# Altium project WWM.PrjPcb (part 1 of 2)
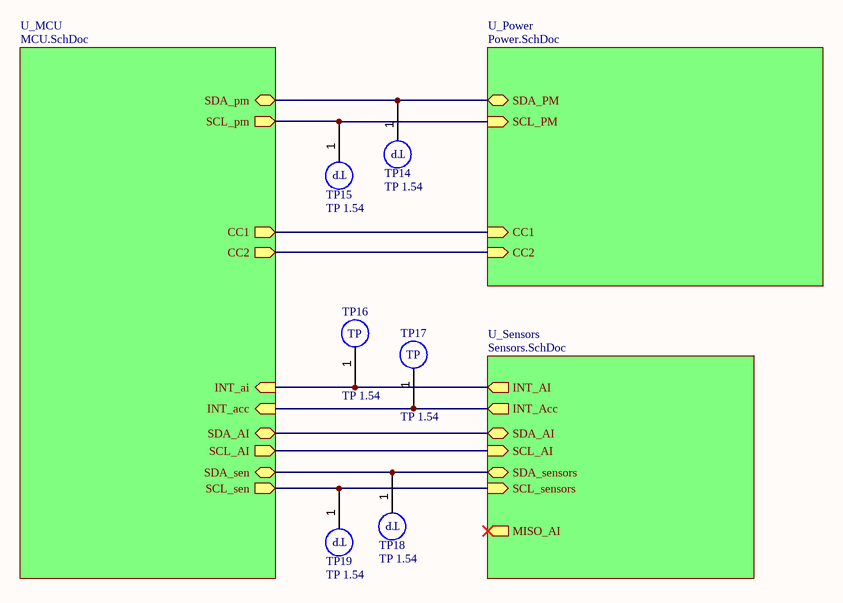
[diagram p0: Main_Sheet.SchDoc]
4 sheets, 114 parts. Net scope: hierarchical (ports join the sheet entries above them; power ports are global).
Board file: PCB1.PcbDoc
Sheets:
  Main_Sheet.SchDoc
    U_Power = Power.SchDoc
    U_Sensors = Sensors.SchDoc
    U_MCU = MCU.SchDoc

## Sheet Main_Sheet.SchDoc
size 431 x 279 mm; SheetNumber: 1; SheetTotal: 4

### Parts
TP14  TP 1.54  [TP-Footprint-1]  (no BOM)
TP15  TP 1.54  [TP-Footprint-1]  (no BOM)
TP16  TP 1.54  [TP-Footprint-1]  (no BOM)
TP17  TP 1.54  [TP-Footprint-1]  (no BOM)
TP18  TP 1.54  [TP-Footprint-1]  (no BOM)
TP19  TP 1.54  [TP-Footprint-1]  (no BOM)

### Sub-sheets
U_MCU = MCU.SchDoc: SDA_sen (bidir), SCL_sen (out), SDA_pm (bidir), INT_acc (in), INT_ai (in), CC2 (out), CC1 (out), SCL_pm (out), SCL_AI (out), SDA_AI (bidir)
U_Power = Power.SchDoc: SDA_PM (bidir), CC1 (in), CC2 (in), SCL_PM (in)
U_Sensors = Sensors.SchDoc: MISO_AI (out), SDA_sensors (bidir), SCL_sensors (in), INT_AI (out), INT_Acc (out), SDA_AI (bidir), SCL_AI (in)

### Nets
CC1: sheet U_Power/CC1, sheet U_MCU/CC1
CC2: sheet U_Power/CC2, sheet U_MCU/CC2
INT1_Acc: TP17.1 ; sheet U_Sensors/INT_Acc, sheet U_MCU/INT_acc
INT_AI: TP16.1 ; sheet U_Sensors/INT_AI, sheet U_MCU/INT_ai
SCL_Acc: TP19.1 ; sheet U_Sensors/SCL_sensors, sheet U_MCU/SCL_sen
SCL_AI: sheet U_Sensors/SCL_AI, sheet U_MCU/SCL_AI
SCL_PM: TP15.1 ; sheet U_Power/SCL_PM, sheet U_MCU/SCL_pm
SDA_Acc: TP18.1 ; sheet U_Sensors/SDA_sensors, sheet U_MCU/SDA_sen
SDA_MOSI_AI: sheet U_Sensors/SDA_AI, sheet U_MCU/SDA_AI
SDA_PM: TP14.1 ; sheet U_Power/SDA_PM, sheet U_MCU/SDA_pm

### Notes on the sheet
- DWG. NO.
- REV.
- SHT.
- THIS DOCUMENT AND THE DATA DISCLOSED HEREIN OR HEREWITH IS THE PROPERTY OF ALTIUM LIMITED AND MAY BE FREELY DISTRIBUTED IN WHOLE. NO RIGHTS ARE RESERVED OR EXPRESS OR IMPLIED WARANTEE GIVEN.
- REVISION
- DESCRIPTION
- DATE
- APPROVED
- ENG:
- APPROVALS
- PROJECT
- DSN:
- CHK:
- REFERENCE DOCUMENTS
- PROJECT REVISION:
- TITLE
- DOCUMENT REVISION:
- DESIGN ITEM:
- BOM:
- FAB DWG:
- PCB DWG:
- ASSY DWG:
- SCALE:
- SIZE
- B
- CAGE CODE
- FILE NAME
- DWG NO.
- SHEET
- OF
- REV
- (in symbol TestPoint-1) TP

### Library data of the parts
TP14-TP19 = TestPoint-1: Rounded rectangular pad 1.54mm

## Sheet Power.SchDoc
size 420 x 297 mm; SheetNumber: 2; SheetTotal: 4
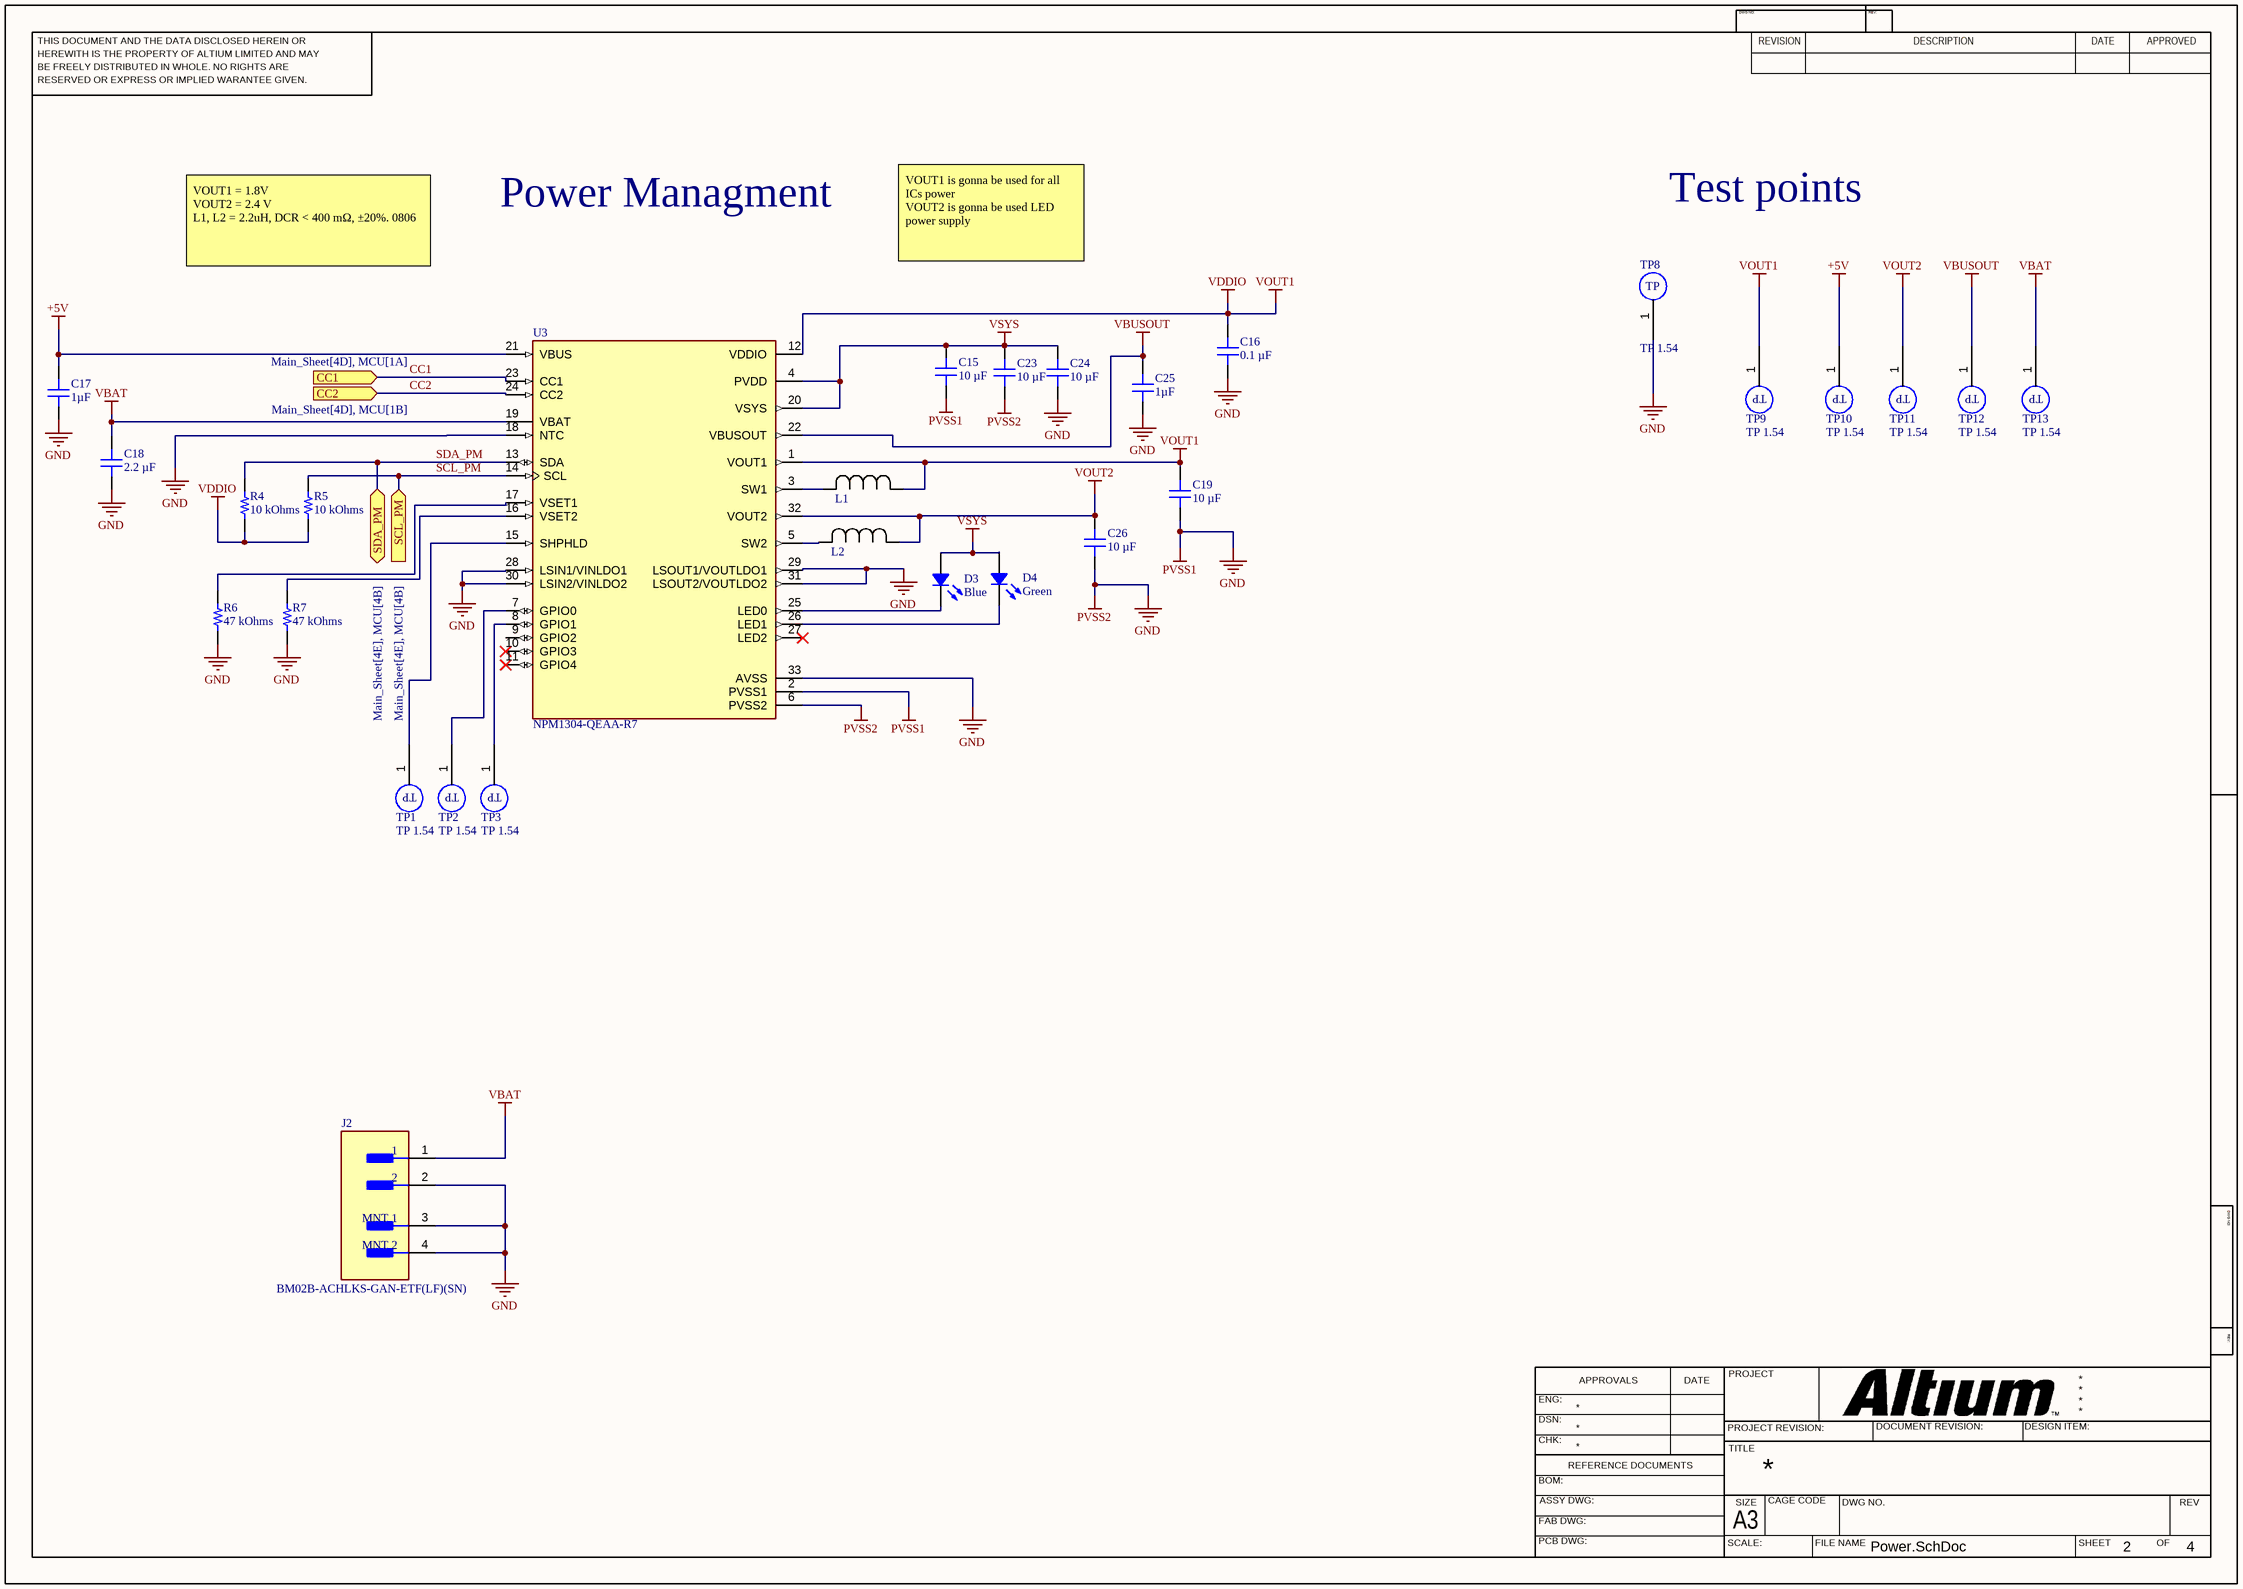
[diagram p1: Power.SchDoc]

### Parts
C15  10 µF  [MURATA GRT188 0603_1608]
C16  0.1 µF  [CAP 0402_1005]
C17  1µF  [CAP 0603_1608]
C18  2.2 µF  [CAP 0603_1608]
C19  10 µF  [MURATA GRT188 0603_1608]
C23  10 µF  [MURATA GRT188 0603_1608]
C24  10 µF  [MURATA GRT188 0603_1608]
C25  1µF  [CAP 0603_1608]
C26  10 µF  [MURATA GRT188 0603_1608]
D3  Blue  [LED 0402_1005 GREEN]
D4  Green  [LED 0402_1005 GREEN]
J2  BM02B-ACHLKS-GAN-ETF(LF)(SN)  [FP-BM02B-ACHLKS-GAN-ETF_L-MFG]
L1  CIGT201610EH2R2MNE  [IND_CIGT2016_SAM]  (value not drawn)
L2  CIGT201610EH2R2MNE  [IND_CIGT2016_SAM]  (value not drawn)
R4  10 kOhms  [RES 0402_1005]
R5  10 kOhms  [RES 0402_1005]
R6  47 kOhms  [RES 0402_1005]
R7  47 kOhms  [RES 0402_1005]
TP1  TP 1.54  [TP-Footprint-1]  (no BOM)
TP2  TP 1.54  [TP-Footprint-1]  (no BOM)
TP3  TP 1.54  [TP-Footprint-1]  (no BOM)
TP8  TP 1.54  [TP-Footprint-1]  (no BOM)
TP9  TP 1.54  [TP-Footprint-1]  (no BOM)
TP10  TP 1.54  [TP-Footprint-1]  (no BOM)
TP11  TP 1.54  [TP-Footprint-1]  (no BOM)
TP12  TP 1.54  [TP-Footprint-1]  (no BOM)
TP13  TP 1.54  [TP-Footprint-1]  (no BOM)
U3  NPM1304-QEAA-R7  [QFN50P500X500X90-33N]

### Ports
CC1 (in, see Main_Sheet[4D], MCU[1A]), CC2 (in, see Main_Sheet[4D], MCU[1B]), SCL_PM (in, see Main_Sheet[4E], MCU[4B]), SDA_PM (bidir, see Main_Sheet[4E], MCU[4B])

### Nets
+5V: C17.2 TP10.1 U3.21(VBUS)
GND: C15.1 C16.1 C17.1 C18.1 C19.1 C23.1 C24.1 C25.1 C26.1 J2.2 J2.3(MNT_1) J2.4(MNT_2) R6.1 R7.1 TP8.1 U3.2(PVSS1) U3.6(PVSS2) U3.18(NTC) U3.28(LSIN1/VINLDO1) U3.29(LSOUT1/VOUTLDO1) U3.30(LSIN2/VINLDO2) U3.31(LSOUT2/VOUTLDO2) U3.33(AVSS)  [also labelled PVSS1, PVSS2]
VBAT: C18.2 J2.1 TP13.1 U3.19(VBAT)
VBUSOUT: C25.2 TP12.1 U3.22(VBUSOUT)
VDDIO: C16.2 C19.2 L1.1 R4.1 R5.1 TP9.1 U3.1(VOUT1) U3.12(VDDIO)  [also labelled VOUT1]  [project net +1.8V_Acc]
VOUT2: C26.2 L2.1 TP11.1 U3.32(VOUT2)  [project net V_LED]
VSYS: C15.2 C23.2 C24.2 D3.1 D4.1 U3.4(PVDD) U3.20(VSYS)
CC1: U3.23(CC1) ; port CC1
CC2: U3.24(CC2) ; port CC2
SCL_PM: R5.2 U3.14(SCL) ; port SCL_PM
SDA_PM: R4.2 U3.13(SDA) ; port SDA_PM
NetD3_2: D3.2 U3.25(LED0)
NetD4_2: D4.2 U3.26(LED1)
NetL1_2: L1.2 U3.3(SW1)
NetL2_2: L2.2 U3.5(SW2)
NetR6_2: R6.2 U3.17(VSET1)
NetR7_2: R7.2 U3.16(VSET2)
NetTP1_1: TP1.1 U3.15(SHPHLD)
NetTP2_1: TP2.1 U3.7(GPIO0)
NetTP3_1: TP3.1 U3.8(GPIO1)

Not connected (* = marked no-connect by the designer): U3 9(GPIO2) 10(GPIO3)* 11(GPIO4)* 27(LED2)*

### Notes on the sheet
- VOUT1 = 1.8V
  VOUT2 = 2.4 V
  L1, L2 = 2.2uH, DCR < 400 mΩ, ±20%. 0806
- Power Managment
- VOUT1 is gonna be used for all ICs power
  VOUT2 is gonna be used LED power supply
- Test points
- THIS DOCUMENT AND THE DATA DISCLOSED HEREIN OR
- HEREWITH IS THE PROPERTY OF ALTIUM LIMITED AND MAY
- DWG NO:
- REVISION
- REV:
- DESCRIPTION
- DATE
- APPROVED
- BE FREELY DISTRIBUTED IN WHOLE. NO RIGHTS ARE
- RESERVED OR EXPRESS OR IMPLIED WARANTEE GIVEN.
- ENG:
- APPROVALS
- PROJECT
- DSN:
- CHK:
- REFERENCE DOCUMENTS
- PROJECT REVISION:
- TITLE
- DOCUMENT REVISION:
- DESIGN ITEM:
- BOM:
- FAB DWG:
- PCB DWG:
- ASSY DWG:
- SCALE:
- A3
- SIZE
- CAGE CODE
- FILE NAME
- DWG NO.
- SHEET
- OF
- REV
- (in symbol TestPoint-1) TP

### Library data of the parts
C15 C19 C23 C24 C26 = GRT188R61C106ME13D: CAP CER 10UF 16V X5R 0603; manufacturer: Murata Electronics; Tolerance: ±20%; Part Number: GRT188R61C106ME13D; Capacitance: 10 µF; Applications: Automotive; componentlink1description: Datasheet; componentlink1url: https://search.murata.co.jp/Ceramy/image/img/A01X/G101/ENG/GRT188R61C106ME13-01.pdf; componentlink2description: DigiKey Link; componentlink2url: https://www.digikey.com/en/products/detail/murata-electronics/GRT188R61C106ME13D/5416740; Device Package: 0603 (1608 Metric); lastupdated: 7/27/2025 6:13:14 AM; Lifecycle Status: Active; Minimum Order: 1; Mounting Type: Surface Mount, MLCC; Operating Temperature: -55°C ~ 85°C; Package / Case: 0603 (1608 Metric); packaging: TapeAndReel; partid: 2515; Part Status: Active; price: 0.06; Ratings: AEC-Q200; series: GRT; Size / Dimension: 0.063" L x 0.031" W (1.60mm x 0.80mm); Supplier 1: DigiKey; Supplier Part Number 1: 490-12318-1-ND; Temperature Coefficient: X5R; Thickness (Max): 0.035" (0.90mm); value: 10 µF; Voltage - Rated: 16V
C16 = CL05B104KP5VPNC: CAP CER 100NF 10V X7R 0402; manufacturer: Samsung Electro-Mechanics; Temperature Coefficient: X5R; Tolerance: ±10%; Voltage - Rated: 16V; Part Number: CL05B104KP5VPNC; Capacitance: 0.1 µF; Applications: Automotive; componentlink1description: Datasheet; componentlink1url: https://mm.digikey.com/Volume0/opasdata/d220001/medias/docus/5458/CL05B104KP5VPNC_Spec.pdf; componentlink2description: DigiKey Link; componentlink2url: https://www.digikey.com/en/products/detail/samsung-electro-mechanics/CL05B104KP5VPNC/20498482; Device Package: 0402 (1005 Metric); lastupdated: 2/9/2024 8:03:17 PM; Lifecycle Status: Active; Minimum Order: 1; Mounting Type: Surface Mount, MLCC; Operating Temperature: -55°C ~ 125°C; Package / Case: 0402 (1005 Metric); packaging: TapeAndReel; partid: 56690; price: 0.01; Ratings: AEC-Q200; series: CL; Size / Dimension: 0.039" L x 0.020" W (1.00mm x 0.50mm); Supplier 1: DigiKey; Supplier Part Number 1: 1276-CL05B104KP5VPNCCT-ND; Thickness (Max): 0.022" (0.55mm); value: 0.1 µF
C17 = 06033D105MAT2A: CAP CER 1UF 25V X5R 0603; manufacturer: AVX Corporation; Tolerance: ±10%; Part Number: 06033D105MAT2A; Capacitance: 1µF; Applications: General Purpose; componentlink1description: Datasheet; componentlink1url: http://datasheets.avx.com/cx5r.pdf; componentlink2description: DigiKey Link; componentlink2url: http://digikey.com/product-detail/en/avx-corporation/06033D105MAT2A/478-4531-1-ND/1645882; Device Package: 0603 (1608 Metric); lastupdated: 9/2/2020 1:03:35 AM; Lifecycle Status: Active; Minimum Order: 1; Mounting Type: Surface Mount, MLCC; Operating Temperature: -55°C ~ 85°C; Package / Case: 0603 (1608 Metric); packaging: TapeAndReel; partid: 2656; Part Status: Active; price: 0.11; series: -; Size / Dimension: 0.063" L x 0.032" W (1.60mm x 0.81mm); Supplier 1: DigiKey; Supplier Part Number 1: 478-4531-1-ND; Temperature Coefficient: X5R; Thickness (Max): 0.035" (0.90mm); value: 1µF; Voltage - Rated: 25V
C18 = CGA3E3X5R1A225K080AB: CAP CER 2.2UF 10V X5R 0603; manufacturer: TDK Corporation; Temperature Coefficient: X7R; Tolerance: ±10%; Voltage - Rated: 16V; Part Number: CGA3E3X5R1A225K080AB; Capacitance: 2.2 µF; Applications: Automotive; componentlink1description: Datasheet; componentlink1url: https://product.tdk.com/info/en/catalog/datasheets/mlcc_automotive_general_en.pdf?ref_disty=digikey; componentlink2description: DigiKey Link; componentlink2url: https://www.digikey.com/en/products/detail/tdk-corporation/CGA3E3X5R1A225K080AB/3949680; Device Package: 0603 (1608 Metric); lastupdated: 2/9/2024 8:10:27 PM; Lifecycle Status: Active; Minimum Order: 1; Mounting Type: Surface Mount, MLCC; Operating Temperature: -55°C ~ 85°C; Package / Case: 0603 (1608 Metric); packaging: TapeAndReel; partid: 4737; Part Status: Active; price: 0.02; Ratings: AEC-Q200; series: CGA; Size / Dimension: 0.063" L x 0.031" W (1.60mm x 0.80mm); Supplier 1: DigiKey; Supplier Part Number 1: 445-12444-1-ND; Thickness (Max): 0.035" (0.90mm); value: 2.2 µF
C25 = 0603ZD105KAT4A: CAP CER 1UF 10V X5R 0603; manufacturer: AVX Corporation; Tolerance: ±10%; Part Number: 0603ZD105KAT4A; Capacitance: 1µF; Applications: General Purpose; componentlink1description: Datasheet; componentlink1url: http://datasheets.avx.com/cx5r.pdf; componentlink2description: DigiKey Link; componentlink2url: http://digikey.com/product-detail/en/avx-corporation/0603ZD105KAT4A/478-12460-1-ND/9749312; Device Package: 0603 (1608 Metric); lastupdated: 9/2/2020 1:03:32 AM; Lifecycle Status: Active; Minimum Order: 1; Mounting Type: Surface Mount, MLCC; Operating Temperature: -55°C ~ 85°C; Package / Case: 0603 (1608 Metric); packaging: TapeAndReel; partid: 4586; Part Status: Active; price: 0.03; series: -; Size / Dimension: 0.063" L x 0.032" W (1.60mm x 0.81mm); Supplier 1: DigiKey; Supplier Part Number 1: 478-12460-1-ND; Temperature Coefficient: X5R; Thickness (Max): 0.035" (0.90mm); value: 1µF; Voltage - Rated: 10V
D3 D4 = SM0402PGC: LED GREEN CLEAR 0402 SMD; Manufacturer: Bivar Inc.; Configuration: 0402; Current - Test: 20mA; Lens Color: Colorless; Lens Size: 0.50mm x 1.00mm; Lens Style: Rectangle with Flat Top; Millicandela Rating: 450mcd; Viewing Angle: 130°; Voltage - Forward (Vf) (Typ): 3.1V; Wavelength - Dominant: 525nm; Wavelength - Peak: 523nm; Part Number: SM0402PGC; Color: Green; ComponentLink1Description: Datasheet; ComponentLink1URL: https://www.bivar.com/Files/Datasheets/SM0402PGC.pdf; ComponentLink2Description: DigiKey Link; ComponentLink2URL: https://www.digikey.com/en/products/detail/bivar-inc/SM0402PGC/6810860; Device Package: 0402 (1005 Metric); Height (Max): 0.71mm; LastUpdated: 8/25/2025 8:34:13 PM; Lens Transparency: Clear; Lifecycle Status: Active; Minimum Order: 1; Mounting Type: Surface Mount; Package / Case: 0402 (1005 Metric); Packaging: TapeAndReel; PartId: 699; Part Status: Active; Price: 0.24; Series: -; Size / Dimension: 1.00mm L x 0.50mm W; Supplier 1: DigiKey; Supplier Part Number 1: 492-2204-1-ND; Supplier Device Package: 0402; Value: Green
J2 = CMP-17439-000451-1: CONN HEADER SMD R/A 2POS 1.2MM; Number of Positions: 2; Voltage Rating: 50V; Pitch: 0.047inch; Insulation Material: Thermoplastic; Contact Plating: Gold; Fastening Type: Detent; Connector Type: Header; Number of Pins: 2; Max Operating Temperature: 85°C; Min Operating Temperature: -25°C; Contact Type: Male Blade; Termination: Solder; Mount: Surface Mount; Contact Material: Copper Alloy; Color: Black; Contact Finish - Mating: GOLD; Series: ACHL; Insulation Color: Black; Lead Free: Lead Free; Flammability Rating: UL94 V-0; Contact Shape: Rectangular; Packaging: Cut Tape; Number of Rows: 1
L1 L2 = CMP-006-00022-1: Description; Manufacturer_Name: Samsung; Manufacturer_Part_Number: CIGT201610EH2R2MNE; Source: CIGT201610EH2R2MNE.SchLib; Copyright: Copyright (C) 2025 Ultra Librarian. All rights reserved.; Design Item ID: CIGT201610EH2R2MNE
R4 R5 = RP73PF1E10KBTD: RES 10K OHM 0.1% 1/10W 0402; Manufacturer: TE Connectivity Passive Product; Power (Watts): 0.1W, 1/10W; Temperature Coefficient: ±25ppm/°C; Tolerance: ±1%; Part Number: RP73PF1E10KBTD; Value: 10 kOhms; ComponentLink1Description: Datasheet; ComponentLink1URL: https://www.te.com/commerce/DocumentDelivery/DDEController?Action=srchrtrv&DocNm=1773272&DocType=DS&DocLang=English; ComponentLink2Description: DigiKey Link; ComponentLink2URL: https://www.digikey.com/en/products/detail/te-connectivity-passive-product/RP73PF1E10KBTD/8260957; Composition: Thin Film; Device Package: 0402 (1005 Metric); Height - Seated (Max): 0.014" (0.35mm); LastUpdated: 2/9/2024 8:30:24 PM; Lifecycle Status: Active; Minimum Order: 1; Number of Terminations: 2; Operating Temperature: -55°C ~ 155°C; Package / Case: 0402 (1005 Metric); Packaging: TapeAndReel; PartId: 2434; Part Status: Active; Price: 0.08; Resistance: 10 kOhms; Series: RP73, Holsworthy; Size / Dimension: 0.039" L x 0.020" W (1.00mm x 0.50mm); Supplier 1: DigiKey; Supplier Part Number 1: A127415CT-ND; Supplier Device Package: 0402
R6 R7 = RMCF0402FT47K0: RES 47K OHM 1% 1/16W 0402; Manufacturer: Stackpole Electronics Inc; Power (Watts): 0.063W, 1/16W; Temperature Coefficient: ±100ppm/°C; Part Number: RMCF0402FT47K0; Value: 47 kOhms; ComponentLink1Description: Datasheet; ComponentLink1URL: https://www.seielect.com/catalog/sei-rmcf_rmcp.pdf; ComponentLink2Description: DigiKey Link; ComponentLink2URL: https://www.digikey.com/en/products/detail/stackpole-electronics-inc/RMCF0402FT47K0/1714749; Composition: Thick Film; Device Package: 0402 (1005 Metric); Features: Automotive AEC-Q200; Height - Seated (Max): 0.016" (0.40mm); LastUpdated: 2/9/2024 8:30:13 PM; Lifecycle Status: Active; Minimum Order: 1; Number of Terminations: 2; Operating Temperature: -55°C ~ 155°C; Package / Case: 0402 (1005 Metric); Packaging: CutTape; PartId: 4957; Part Status: Active; Price: 0.01; Ratings: AEC-Q200; Resistance: 47 kOhms; Series: RMCF; Size / Dimension: 0.039" L x 0.020" W (1.00mm x 0.50mm); Supplier 1: DigiKey; Supplier Part Number 1: RMCF0402FT47K0CT-ND; Supplier Device Package: 0402; Tolerance: ±1%
TP1-TP3 TP8-TP13 = TestPoint-1: Rounded rectangular pad 1.54mm
U3 = CMP-031-00007-2: NPM1304 POWER MANAGEMENT IC; MF: Nordic Semiconductor ASA; SnapEDA_Link: https://www.snapeda.com/parts/NPM1304-QEAA-R7/Nordic+Power/view-part/?ref=snap; Pins: 33; Design Item ID: NPM1304-QEAA-R7; Case/Package: None; MP: NPM1304-QEAA-R7; Check_prices: https://www.snapeda.com/parts/NPM1304-QEAA-R7/Nordic+Power/view-part/?ref=eda; Source: NPM1304-QEAA-R7.SchLib; Value: *; Component Type: Standard

## Sheet Sensors.SchDoc
size 420 x 297 mm; SheetNumber: 3; SheetTotal: 4
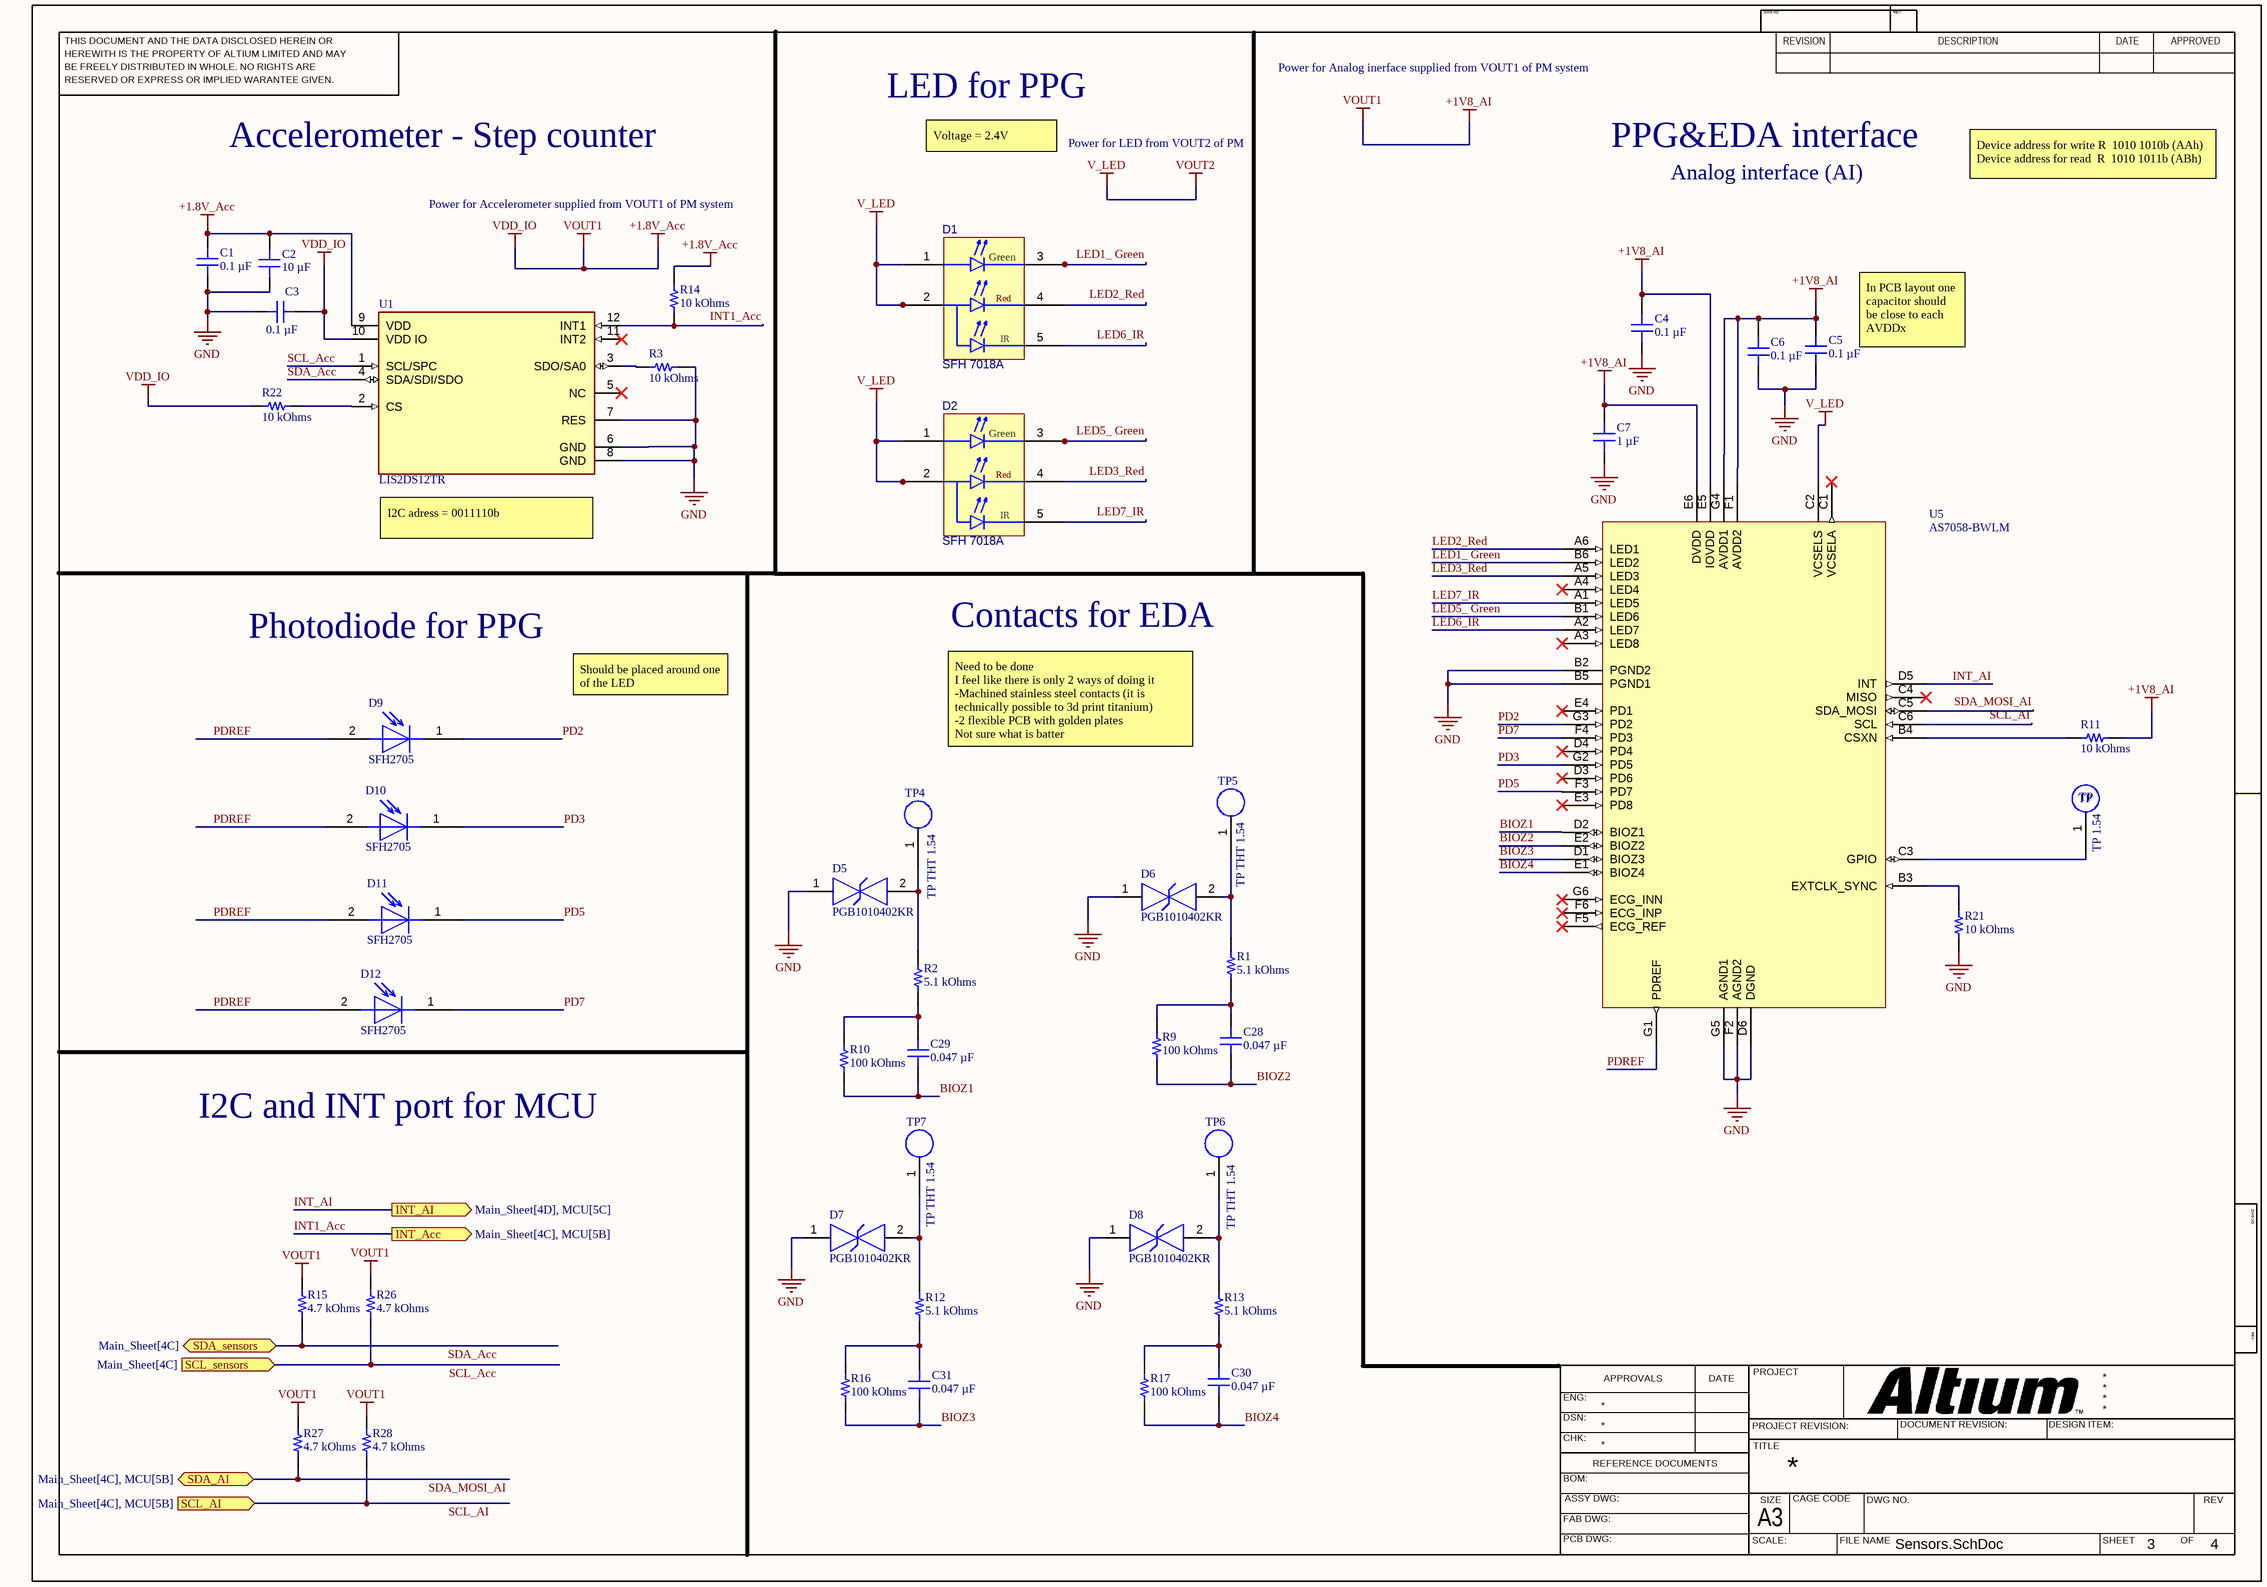
[diagram p2: Sensors.SchDoc]

### Parts
C1  0.1 µF  [CAP 0402_1005]
C2  10 µF  [CAP 0402_1005]
C3  0.1 µF  [CAP 0402_1005]
C4  0.1 µF  [CAP 0402_1005]
C5  0.1 µF  [CAP 0402_1005]
C6  0.1 µF  [CAP 0402_1005]
C7  1 µF  [CAP 0402_1005]
C28  0.047 µF  [CAP 0402_1005]
C29  0.047 µF  [CAP 0402_1005]
C30  0.047 µF  [CAP 0402_1005]
C31  0.047 µF  [CAP 0402_1005]
D1  SFH 7018A  [SFH 7018A-Footprint-1]
D2  SFH 7018A  [SFH 7018A-Footprint-1]
D5  PGB1010402KR  [FP-PGB1-0402-MFG]
D6  PGB1010402KR  [FP-PGB1-0402-MFG]
D7  PGB1010402KR  [FP-PGB1-0402-MFG]
D8  PGB1010402KR  [FP-PGB1-0402-MFG]
D9  SFH2705  [DFN175P215X60-2N]
D10  SFH2705  [DFN175P215X60-2N]
D11  SFH2705  [DFN175P215X60-2N]
D12  SFH2705  [DFN175P215X60-2N]
R1  5.1 kOhms  [RES 0402_1005]
R2  5.1 kOhms  [RES 0402_1005]
R3  10 kOhms  [RES 0402_1005]
R9  100 kOhms  [YAGEO RES 0402_1005]
R10  100 kOhms  [YAGEO RES 0402_1005]
R11  10 kOhms  [RES 0402_1005]
R12  5.1 kOhms  [RES 0402_1005]
R13  5.1 kOhms  [RES 0402_1005]
R14  10 kOhms  [RES 0402_1005]
R15  4.7 kOhms  [YAGEO RES 0402_1005]
R16  100 kOhms  [YAGEO RES 0402_1005]
R17  100 kOhms  [YAGEO RES 0402_1005]
R21  10 kOhms  [RES 0402_1005]
R22  10 kOhms  [RES 0402_1005]
R26  4.7 kOhms  [YAGEO RES 0402_1005]
R27  4.7 kOhms  [YAGEO RES 0402_1005]
R28  4.7 kOhms  [YAGEO RES 0402_1005]
TP  TP 1.54  [TP-Footprint-1]  (no BOM)
TP4  TP THT 1.54  [TP-Footprint-1]  (no BOM)
TP5  TP THT 1.54  [TP-Footprint-1]  (no BOM)
TP6  TP THT 1.54  [TP-Footprint-1]  (no BOM)
TP7  TP THT 1.54  [TP-Footprint-1]  (no BOM)
U1  LIS2DS12TR  [FP-LGA12_8566956-MFG]
U5  AS7058-BWLM  [BGA42C40P6X7_254X282X60]

### Ports
INT_Acc (out, see Main_Sheet[4C], MCU[5B]), INT_AI (out, see Main_Sheet[4D], MCU[5C]), SCL_AI (in, see Main_Sheet[4C], MCU[5B]), SCL_sensors (in, see Main_Sheet[4C]), SDA_AI (bidir, see Main_Sheet[4C], MCU[5B]), SDA_sensors (bidir, see Main_Sheet[4C])

### Nets
+1.8V_Acc: C1.2 C2.2 C3.1 C4.2 C5.2 C6.2 C7.2 R11.2 R14.2 R15.2 R22.1 R26.2 R27.2 R28.2 U1.9(VDD) U1.10(VDD_IO) U5.E5(IOVDD) U5.E6(DVDD) U5.F1(AVDD2) U5.G4(AVDD1)  [also labelled +1V8_AI, VDD_IO, VOUT1]
GND: C1.1 C2.1 C3.2 C4.1 C5.1 C6.1 C7.1 D5.1 D6.1 D7.1 D8.1 R3.2 R21.1 U1.6(GND) U1.7(RES) U1.8(GND) U5.B2(PGND2) U5.B5(PGND1) U5.D6(DGND) U5.F2(AGND2) U5.G5(AGND1)
V_LED: D1.1 D1.2 D1.6 D2.1 D2.2 D2.6 U5.C2(VCSELS)  [also labelled VOUT2]
BIOZ1: C29.1 R10.1 U5.D2(BIOZ1)
BIOZ2: C28.1 R9.1 U5.E2(BIOZ2)
BIOZ3: C31.1 R16.1 U5.D1(BIOZ3)
BIOZ4: C30.1 R17.1 U5.E1(BIOZ4)
INT1_Acc: R14.1 U1.12(INT1) ; port INT_Acc
INT_AI: U5.D5(INT) ; port INT_AI
LED1_ Green: D1.3 D1.7 D1.8 U5.B6(LED2)
LED2_Red: D1.4 U5.A6(LED1)
LED3_Red: D2.4 U5.A5(LED3)
LED5_ Green: D2.3 D2.7 D2.8 U5.B1(LED6)
LED6_IR: D1.5 U5.A2(LED7)
LED7_IR: D2.5 U5.A1(LED5)
PD2: D9.1 U5.G3(PD2)
PD3: D10.1 U5.G2(PD5)
PD5: D11.1 U5.F3(PD7)
PD7: D12.1 U5.F4(PD3)
PDREF: D9.2 D10.2 D11.2 D12.2 U5.G1(PDREF)
SCL_Acc: R26.1 U1.1(SCL/SPC) ; port SCL_sensors
SCL_AI: R28.1 U5.C6(SCL) ; port SCL_AI
SDA_Acc: R15.1 U1.4(SDA/SDI/SDO) ; port SDA_sensors
SDA_MOSI_AI: R27.1 U5.C5(SDA_MOSI) ; port SDA_AI
NetC28_2: C28.2 R1.1 R9.2
NetC29_2: C29.2 R2.1 R10.2
NetC30_2: C30.2 R13.1 R17.2
NetC31_2: C31.2 R12.1 R16.2
NetD5_2: D5.2 R2.2 TP4.1
NetD6_2: D6.2 R1.2 TP5.1
NetD7_2: D7.2 R12.2 TP7.1
NetD8_2: D8.2 R13.2 TP6.1
NetR3_1: R3.1 U1.3(SDO/SA0)
NetR11_1: R11.1 U5.B4(CSXN)
NetR21_2: R21.2 U5.B3(EXTCLK_SYNC)
NetR22_2: R22.2 U1.2(CS)
NetTP_1: TP.1 U5.C3(GPIO)

Not connected (* = marked no-connect by the designer): U1 5(NC)* 11(INT2)*; U5 A3(LED8)* A4(LED4)* C1(VCSELA)* C4(MISO)* D3(PD6)* D4(PD4)* E3(PD8)* E4(PD1)* F5(ECG_REF)* F6(ECG_INP)* G6(ECG_INN)*

### Notes on the sheet
- LED for PPG
- Power for Analog inerface supplied from VOUT1 of PM system
- Accelerometer - Step counter
- Voltage = 2.4V
- Power for LED from VOUT2 of PM
- PPG&EDA interface
- Analog interface (AI)
- Device address for write R  1010 1010b (AAh)
  Device address for read  R  1010 1011b (ABh)
- Power for Accelerometer supplied from VOUT1 of PM system
- (near C5) In PCB layout one capacitor should be close to each AVDDx
- (near U1) I2C adress = 0011110b
- Photodiode for PPG
- Contacts for EDA
- Should be placed around one of the LED
- Need to be done
  I feel like there is only 2 ways of doing it
  -Machined stainless steel contacts (it is technically possible to 3d print titanium)
  -2 flexible PCB with golden plates
  Not sure what is batter
- I2C and INT port for MCU
- THIS DOCUMENT AND THE DATA DISCLOSED HEREIN OR
- HEREWITH IS THE PROPERTY OF ALTIUM LIMITED AND MAY
- DWG NO:
- REVISION
- REV:
- DESCRIPTION
- DATE
- APPROVED
- BE FREELY DISTRIBUTED IN WHOLE. NO RIGHTS ARE
- RESERVED OR EXPRESS OR IMPLIED WARANTEE GIVEN.
- ENG:
- APPROVALS
- PROJECT
- DSN:
- CHK:
- REFERENCE DOCUMENTS
- PROJECT REVISION:
- TITLE
- DOCUMENT REVISION:
- DESIGN ITEM:
- BOM:
- FAB DWG:
- PCB DWG:
- ASSY DWG:
- SCALE:
- A3
- SIZE
- CAGE CODE
- FILE NAME
- DWG NO.
- SHEET
- OF
- REV
- (in symbol CMP-007-00036-4) Green; Red; IR

### Library data of the parts
C1 C3 C5 C6 = CL05B104KP5VPNC: CAP CER 100NF 10V X7R 0402; manufacturer: Samsung Electro-Mechanics; Tolerance: ±10%; Part Number: CL05B104KP5VPNC; Capacitance: 0.1 µF; Applications: Automotive; componentlink1description: Datasheet; componentlink1url: https://mm.digikey.com/Volume0/opasdata/d220001/medias/docus/5458/CL05B104KP5VPNC_Spec.pdf; componentlink2description: DigiKey Link; componentlink2url: https://www.digikey.com/en/products/detail/samsung-electro-mechanics/CL05B104KP5VPNC/20498482; Device Package: 0402 (1005 Metric); lastupdated: 2/9/2024 8:03:17 PM; Lifecycle Status: Active; Minimum Order: 1; Mounting Type: Surface Mount, MLCC; Operating Temperature: -55°C ~ 125°C; Package / Case: 0402 (1005 Metric); packaging: TapeAndReel; partid: 56690; price: 0.01; Ratings: AEC-Q200; series: CL; Size / Dimension: 0.039" L x 0.020" W (1.00mm x 0.50mm); Supplier 1: DigiKey; Supplier Part Number 1: 1276-CL05B104KP5VPNCCT-ND; Temperature Coefficient: X7R; Thickness (Max): 0.022" (0.55mm); value: 0.1 µF; Voltage - Rated: 10V
C2 = CL05A106MP8NUB8: CAP CER 10UF 10V X5R 0402; manufacturer: Samsung Electro-Mechanics; Tolerance: ±20%; Part Number: CL05A106MP8NUB8; Capacitance: 10 µF; Applications: Acoustic Noise Reduction; componentlink1description: Datasheet; componentlink1url: http://www.samsungsem.com/kr/support/product-search/mlcc/CL05A106MP8NUB8.jsp; componentlink2description: DigiKey Link; componentlink2url: https://www.digikey.com/en/products/detail/samsung-electro-mechanics/CL05A106MP8NUB8/5961314; Device Package: 0402 (1005 Metric); lastupdated: 2/9/2024 8:04:38 PM; Lifecycle Status: Active; Minimum Order: 1; Mounting Type: Surface Mount, MLCC; Operating Temperature: -55°C ~ 85°C; Package / Case: 0402 (1005 Metric); packaging: TapeAndReel; partid: 1758; Part Status: Active; price: 0.06; series: CL; Size / Dimension: 0.039" L x 0.020" W (1.00mm x 0.50mm); Supplier 1: DigiKey; Supplier Part Number 1: 1276-6830-1-ND; Temperature Coefficient: X5R; Thickness (Max): 0.035" (0.90mm); value: 10 µF; Voltage - Rated: 10V
C4 = CL05B104KP5VPNC: CAP CER 100NF 10V X7R 0402; manufacturer: Samsung Electro-Mechanics; Temperature Coefficient: X5R; Tolerance: ±10%; Part Number: CL05B104KP5VPNC; Capacitance: 0.1 µF; Applications: Automotive; componentlink1description: Datasheet; componentlink1url: https://mm.digikey.com/Volume0/opasdata/d220001/medias/docus/5458/CL05B104KP5VPNC_Spec.pdf; componentlink2description: DigiKey Link; componentlink2url: https://www.digikey.com/en/products/detail/samsung-electro-mechanics/CL05B104KP5VPNC/20498482; Device Package: 0402 (1005 Metric); lastupdated: 2/9/2024 8:03:17 PM; Lifecycle Status: Active; Minimum Order: 1; Mounting Type: Surface Mount, MLCC; Operating Temperature: -55°C ~ 125°C; Package / Case: 0402 (1005 Metric); packaging: TapeAndReel; partid: 56690; price: 0.01; Ratings: AEC-Q200; series: CL; Size / Dimension: 0.039" L x 0.020" W (1.00mm x 0.50mm); Supplier 1: DigiKey; Supplier Part Number 1: 1276-CL05B104KP5VPNCCT-ND; Thickness (Max): 0.022" (0.55mm); value: 0.1 µF; Voltage - Rated: 10V
C7 = 885012105012: CAP CER 1UF 10V X5R 0402; manufacturer: Würth Elektronik; Tolerance: ±20%; Part Number: 885012105012; Capacitance: 1 µF; Applications: General Purpose; componentlink1description: Datasheet; componentlink1url: https://katalog.we-online.de/pbs/datasheet/885012105012.pdf; componentlink2description: DigiKey Link; componentlink2url: https://www.digikey.com/en/products/detail/würth-elektronik/885012105012/5453344; Device Package: 0402 (1005 Metric); lastupdated: 2/9/2024 8:04:38 PM; Lifecycle Status: Active; Minimum Order: 1; Mounting Type: Surface Mount, MLCC; Operating Temperature: -55°C ~ 85°C; Package / Case: 0402 (1005 Metric); packaging: TapeAndReel; partid: 1807; Part Status: Active; price: 0.16; series: WCAP-CSGP; Size / Dimension: 0.039" L x 0.020" W (1.00mm x 0.50mm); Supplier 1: DigiKey; Supplier Part Number 1: 732-7489-1-ND; Temperature Coefficient: X5R; Thickness (Max): 0.022" (0.55mm); value: 1 µF; Voltage - Rated: 10V
C28-C31 = C0402C473K3REC7867: CAP CER 0402 47NF 25V X7R 10%; manufacturer: KEMET; Part Number: C0402C473K3REC7867; Capacitance: 0.047 µF; Applications: ESD Protection; componentlink1description: Datasheet; componentlink1url: https://api.kemet.com/component-edge/download/datasheet/C0402C473K3REC7867.pdf; componentlink2description: DigiKey Link; componentlink2url: https://www.digikey.com/en/products/detail/kemet/C0402C473K3REC7867/8643594; Device Package: 0402 (1005 Metric); lastupdated: 2/9/2024 8:04:15 PM; Lifecycle Status: Active; Minimum Order: 1; Mounting Type: Surface Mount, MLCC; Operating Temperature: -55°C ~ 125°C; Package / Case: 0402 (1005 Metric); packaging: TapeAndReel; partid: 33555; Part Status: Active; price: 0.01; series: ESD SMD Comm X7R; Size / Dimension: 0.039" L x 0.020" W (1.00mm x 0.50mm); Supplier 1: DigiKey; Supplier Part Number 1: 399-C0402C473K3REC7867CT-ND; Temperature Coefficient: X7R; Thickness (Max): 0.022" (0.55mm); Tolerance: ±10%; value: 0.047 µF; Voltage - Rated: 25V
D1 D2 = CMP-007-00036-4: Led, Hr/ir/tg, 655/940/532NM, 120DEG Rohs Compliant: Yes; pin to pad: 1>6 3>1 4>5 5>3 6>4; Colour: Green, Red, IR
D5-D8 = CMP-2000-05189-2: TVS DIODE 12V 250V 0402; Manufacturer: Littelfuse; Capacitance: 0.04pF; Direction: Bidirectional; Number Of Channels: 1; Value: 0.04pF; Automotive: No; Temperature: -65°C to +125°C; Category: Diode; Device Class L2: TVS Diodes; Temperature Range High: +125°C; Octopart: https://octopart.com/pgb1010402kr-littelfuse-10444990; Temperature Range Low: -65°C; Digikey Description: TVS DIODE 12V 250V 0402; RoHS: TRUE; Lead Free: Yes; Ipc Land Pattern Name: DIOC9951X31; ComponentLink2URL: https://www.littelfuse.com/~/media/electronics/datasheets/pulseguard_esd_suppressors/littelfuse_pulseguard_pgb1_datasheet.pdf.pdf; Manufacturer Part Number: PGB1010402KR; Device Class L1: Circuit Protection; Package: PGB1-0402; Mouser Description: ESD Suppressors / TVS Diodes PULSEGUARD 0402 ESD SUPPRESSOR; Clamping Voltage: 250V; Device Class L3: unset; Height: 0.39mm; ComponentLink2Description: Datasheet
D9-D12 = CMP-00026-00001-2: Photodiode with wide range of wavelength
R1 R2 R12 R13 = ERJ-PA2F5101X: RES 5.1K OHM 1% 1/4W 0402; Manufacturer: Panasonic Electronic Components; Power (Watts): 0.25W, 1/4W; Temperature Coefficient: ±100ppm/°C; Part Number: ERJ-PA2F5101X; Value: 5.1 kOhms; ComponentLink1Description: Datasheet; ComponentLink1URL: https://industrial.panasonic.com/cdbs/www-data/pdf/RDO0000/AOA0000C331.pdf; ComponentLink2Description: DigiKey Link; ComponentLink2URL: https://www.digikey.com/en/products/detail/panasonic-electronic-components/ERJ-PA2F5101X/9815254; Composition: Thick Film; Device Package: 0402 (1005 Metric); Features: Automotive AEC-Q200, Pulse Withstanding; Height - Seated (Max): 0.016" (0.40mm); LastUpdated: 2/9/2024 8:30:01 PM; Lifecycle Status: Active; Minimum Order: 1; Number of Terminations: 2; Operating Temperature: -55°C ~ 155°C; Package / Case: 0402 (1005 Metric); Packaging: TapeAndReel; PartId: 8439; Part Status: Active; Price: 0.02; Ratings: AEC-Q200; Resistance: 5.1 kOhms; Series: ERJ-PA2; Size / Dimension: 0.039" L x 0.020" W (1.00mm x 0.50mm); Supplier 1: DigiKey; Supplier Part Number 1: P124488CT-ND; Supplier Device Package: 402; Tolerance: ±1%
R3 R11 R14 R22 = RP73PF1E10KBTD: as R4 on sheet Power; Part Number: RP73PF1E10KBTD; Value: 10 kOhms; ComponentLink1Description: Datasheet; ComponentLink1URL: https://www.te.com/commerce/DocumentDelivery/DDEController?Action=srchrtrv&DocNm=1773272&DocType=DS&DocLang=English; ComponentLink2Description: DigiKey Link; ComponentLink2URL: https://www.digikey.com/en/products/detail/te-connectivity-passive-product/RP73PF1E10KBTD/8260957; Composition: Thin Film; Device Package: 0402 (1005 Metric); Height - Seated (Max): 0.014" (0.35mm); LastUpdated: 2/9/2024 8:30:24 PM; Lifecycle Status: Active; Minimum Order: 1; Number of Terminations: 2; Operating Temperature: -55°C ~ 155°C; Package / Case: 0402 (1005 Metric); Packaging: TapeAndReel; PartId: 2434; Part Status: Active; Price: 0.08; Resistance: 10 kOhms; Series: RP73, Holsworthy; Size / Dimension: 0.039" L x 0.020" W (1.00mm x 0.50mm); Supplier 1: DigiKey; Supplier Part Number 1: A127415CT-ND; Supplier Device Package: 0402
R9 R10 R16 R17 = SR0402FR-7T100KL: RES 100K OHM 1% 1/5W 0402; Manufacturer: Yageo; Power (Watts): 0.2W, 1/5W; Temperature Coefficient: ±100ppm/°C; Part Number: SR0402FR-7T100KL; Value: 100 kOhms; ComponentLink1Description: Datasheet; ComponentLink1URL: http://www.yageo.com/documents/recent/PYu-SR_D_F%20tol_RoHS_L_4.pdf; ComponentLink2Description: DigiKey Link; ComponentLink2URL: https://www.digikey.com/en/products/detail/yageo/SR0402FR-7T100KL/9373087; Composition: Thick Film; Device Package: 0402 (1005 Metric); Features: Automotive AEC-Q200, Pulse Withstanding; Height - Seated (Max): 0.016" (0.40mm); LastUpdated: 8/31/2025 3:04:17 PM; Lifecycle Status: Active; Minimum Order: 1; Number of Terminations: 2; Operating Temperature: -55°C ~ 155°C; Package / Case: 0402 (1005 Metric); Packaging: TapeAndReel; PartId: 4405; Part Status: Active; Price: 0.09; Ratings: AEC-Q200; Resistance: 100 kOhms; Series: SR; Size / Dimension: 0.039" L x 0.020" W (1.00mm x 0.50mm); Supplier 1: DigiKey; Supplier Part Number 1: YAG5813CT-ND; Supplier Device Package: 0402; Tolerance: ±1%
R15 R26-R28 = RT0402FRE074K7L: RES SMD 4.7K OHM 1% 1/16W 0402; Manufacturer: Yageo; Power (Watts): 0.063W, 1/16W; Temperature Coefficient: ±50ppm/°C; Part Number: RT0402FRE074K7L; Value: 4.7 kOhms; ComponentLink1Description: Datasheet; ComponentLink1URL: https://www.yageo.com/upload/media/product/productsearch/datasheet/rchip/PYu-RT_1-to-0.01_RoHS_L_11.pdf; ComponentLink2Description: DigiKey Link; ComponentLink2URL: https://www.digikey.com/en/products/detail/yageo/RT0402FRE074K7L/1072052; Composition: Thin Film; Device Package: 0402 (1005 Metric); Height - Seated (Max): 0.014" (0.35mm); LastUpdated: 8/31/2025 3:04:17 PM; Lifecycle Status: Active; Minimum Order: 1; Number of Terminations: 2; Operating Temperature: -55°C ~ 155°C; Package / Case: 0402 (1005 Metric); Packaging: TapeAndReel; PartId: 3198; Part Status: Active; Price: 0.01; Resistance: 4.7 kOhms; Series: RT; Size / Dimension: 0.039" L x 0.020" W (1.00mm x 0.50mm); Supplier 1: DigiKey; Supplier Part Number 1: YAG3347CT-ND; Supplier Device Package: 0402; Tolerance: ±1%
R21 = RP73PF1E10KBTD: RES 10K OHM 0.1% 1/10W 0402; Manufacturer: TE Connectivity Passive Product; Power (Watts): 0.1W, 1/10W; Temperature Coefficient: ±25ppm/°C; Part Number: RP73PF1E10KBTD; Value: 10 kOhms; ComponentLink1Description: Datasheet; ComponentLink1URL: https://www.te.com/commerce/DocumentDelivery/DDEController?Action=srchrtrv&DocNm=1773272&DocType=DS&DocLang=English; ComponentLink2Description: DigiKey Link; ComponentLink2URL: https://www.digikey.com/en/products/detail/te-connectivity-passive-product/RP73PF1E10KBTD/8260957; Composition: Thin Film; Device Package: 0402 (1005 Metric); Height - Seated (Max): 0.014" (0.35mm); LastUpdated: 2/9/2024 8:30:24 PM; Lifecycle Status: Active; Minimum Order: 1; Number of Terminations: 2; Operating Temperature: -55°C ~ 155°C; Package / Case: 0402 (1005 Metric); Packaging: TapeAndReel; PartId: 2434; Part Status: Active; Price: 0.08; Resistance: 10 kOhms; Series: RP73, Holsworthy; Size / Dimension: 0.039" L x 0.020" W (1.00mm x 0.50mm); Supplier 1: DigiKey; Supplier Part Number 1: A127415CT-ND; Supplier Device Package: 0402; Tolerance: ±0.1%
TP = TestPoint-1: Rounded rectangular pad 1.54mm
TP4-TP7 = CMP-00001-1: Test pint THT round via 1.54mm pad 1mm hole
U1 = CMP-12175-000010-1: ACCEL 2-16G I2C/SPI 12LGA; Operating Supply Voltage: 1.98V; Bandwidth: 6.25Hz; Axis: X, Y, Z; Output Type: SPI; Case/Package: LGA; Min Operating Temperature: -40°C; Lead Free: Lead Free; Mount: Surface Mount; Max Operating Temperature: 85°C; Contact Plating: Gold; Number of Pins: 12; Packaging: Tape and Reel
U5 = CMP-015-00012-3: AS7058 Series 1.8 V PPG/ECG/BioZ/EDA Vital Sign Monitoring IC - WLCSP-42